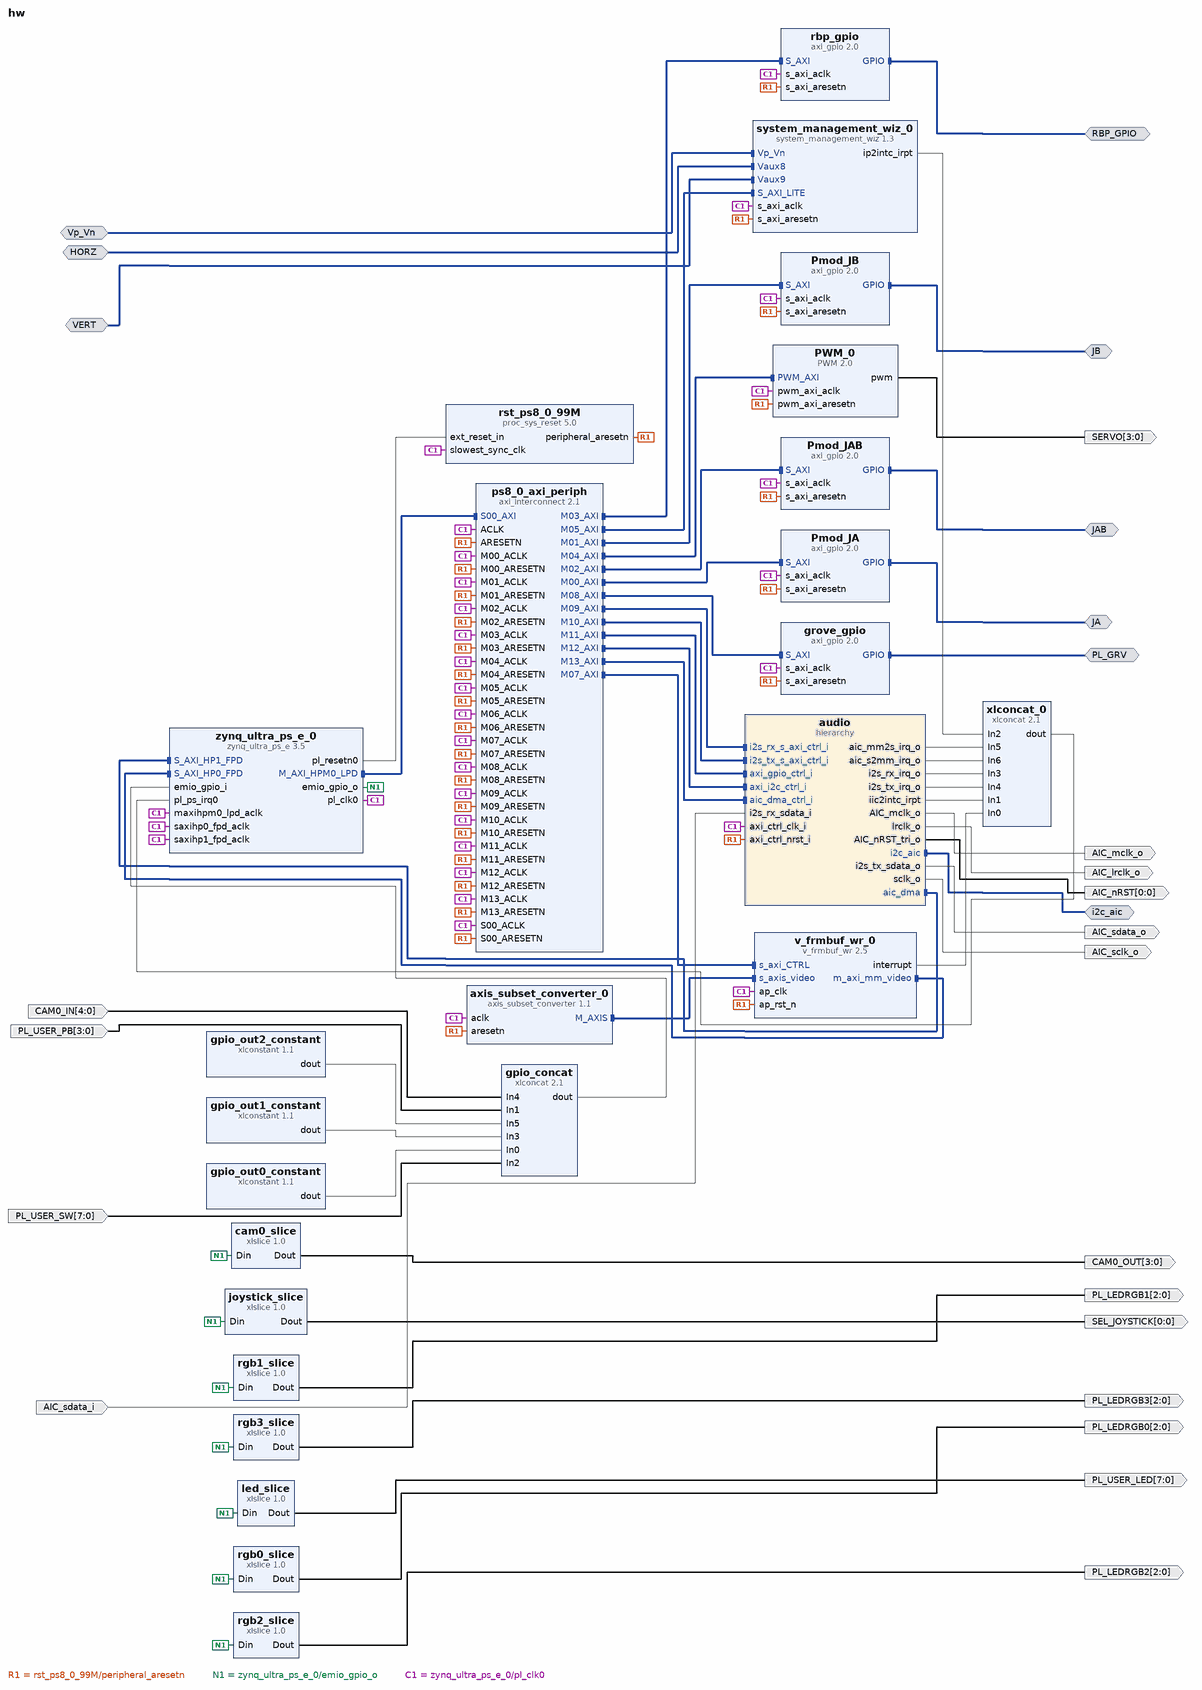
[diagram p0: block diagram of the top level]
# Vivado block design hw, xczu3eg-sfvc784-2-e, Vivado 2024.1
create_bd_design hw

create_bd_intf_port -mode Slave -vlnv xilinx.com:interface:diff_analog_io_rtl:1.0 HORZ
create_bd_intf_port -mode Master -vlnv xilinx.com:interface:gpio_rtl:1.0 JA
create_bd_intf_port -mode Master -vlnv xilinx.com:interface:gpio_rtl:1.0 JAB
create_bd_intf_port -mode Master -vlnv xilinx.com:interface:gpio_rtl:1.0 JB
create_bd_intf_port -mode Master -vlnv xilinx.com:interface:gpio_rtl:1.0 PL_GRV
create_bd_intf_port -mode Master -vlnv xilinx.com:interface:gpio_rtl:1.0 RBP_GPIO
create_bd_intf_port -mode Slave -vlnv xilinx.com:interface:diff_analog_io_rtl:1.0 VERT
create_bd_intf_port -mode Slave -vlnv xilinx.com:interface:diff_analog_io_rtl:1.0 Vp_Vn
create_bd_intf_port -mode Master -vlnv xilinx.com:interface:iic_rtl:1.0 i2c_aic
create_bd_port -dir O AIC_lrclk_o
create_bd_port -dir O AIC_mclk_o
create_bd_port -dir O -from 0 -to 0 AIC_nRST
create_bd_port -dir O AIC_sclk_o
create_bd_port -dir I AIC_sdata_i
create_bd_port -dir O AIC_sdata_o
create_bd_port -dir I -from 4 -to 0 CAM0_IN
create_bd_port -dir O -from 3 -to 0 CAM0_OUT
create_bd_port -dir O -from 2 -to 0 PL_LEDRGB0
create_bd_port -dir O -from 2 -to 0 PL_LEDRGB1
create_bd_port -dir O -from 2 -to 0 PL_LEDRGB2
create_bd_port -dir O -from 2 -to 0 PL_LEDRGB3
create_bd_port -dir O -from 7 -to 0 PL_USER_LED
create_bd_port -dir I -from 3 -to 0 PL_USER_PB
create_bd_port -dir I -from 7 -to 0 PL_USER_SW
create_bd_port -dir O -from 0 -to 0 SEL_JOYSTICK
create_bd_port -dir O -from 3 -to 0 SERVO

create_bd_cell -type ip -vlnv digilentinc.com:IP:PWM:2.0 PWM_0
set_property -dict {CONFIG.NUM_PWM 4} [get_bd_cells PWM_0]
create_bd_cell -type ip -vlnv xilinx.com:ip:axi_gpio:2.0 Pmod_JA
set_property -dict {CONFIG.C_GPIO_WIDTH 8} [get_bd_cells Pmod_JA]
create_bd_cell -type ip -vlnv xilinx.com:ip:axi_gpio:2.0 Pmod_JAB
set_property -dict {CONFIG.C_GPIO_WIDTH 6} [get_bd_cells Pmod_JAB]
create_bd_cell -type ip -vlnv xilinx.com:ip:axi_gpio:2.0 Pmod_JB
set_property -dict {CONFIG.C_GPIO_WIDTH 8} [get_bd_cells Pmod_JB]
create_bd_cell -type hier audio
create_bd_cell -type ip -vlnv xilinx.com:ip:axis_subset_converter:1.1 axis_subset_converter_0
set_property -dict {CONFIG.M_TDATA_NUM_BYTES 6} [get_bd_cells axis_subset_converter_0]
create_bd_cell -type ip -vlnv xilinx.com:ip:xlslice:1.0 cam0_slice
set_property -dict {CONFIG.DIN_FROM 37 CONFIG.DIN_TO 34 CONFIG.DIN_WIDTH 64 CONFIG.DOUT_WIDTH 4} [get_bd_cells cam0_slice]
create_bd_cell -type ip -vlnv xilinx.com:ip:xlconcat:2.1 gpio_concat
set_property -dict {CONFIG.NUM_PORTS 6} [get_bd_cells gpio_concat]
create_bd_cell -type ip -vlnv xilinx.com:ip:xlconstant:1.1 gpio_out0_constant
set_property -dict {CONFIG.CONST_VAL 0 CONFIG.CONST_WIDTH 20} [get_bd_cells gpio_out0_constant]
create_bd_cell -type ip -vlnv xilinx.com:ip:xlconstant:1.1 gpio_out1_constant
set_property -dict {CONFIG.CONST_VAL 0 CONFIG.CONST_WIDTH 6} [get_bd_cells gpio_out1_constant]
create_bd_cell -type ip -vlnv xilinx.com:ip:xlconstant:1.1 gpio_out2_constant
set_property -dict {CONFIG.CONST_VAL 0 CONFIG.CONST_WIDTH 21} [get_bd_cells gpio_out2_constant]
create_bd_cell -type ip -vlnv xilinx.com:ip:axi_gpio:2.0 grove_gpio
set_property -dict {CONFIG.C_GPIO_WIDTH 4 CONFIG.C_IS_DUAL 0} [get_bd_cells grove_gpio]
create_bd_cell -type ip -vlnv xilinx.com:ip:xlslice:1.0 joystick_slice
set_property -dict {CONFIG.DIN_FROM 32 CONFIG.DIN_TO 32 CONFIG.DIN_WIDTH 64 CONFIG.DOUT_WIDTH 1} [get_bd_cells joystick_slice]
create_bd_cell -type ip -vlnv xilinx.com:ip:xlslice:1.0 led_slice
set_property -dict {CONFIG.DIN_FROM 7 CONFIG.DIN_TO 0 CONFIG.DIN_WIDTH 64 CONFIG.DOUT_WIDTH 8} [get_bd_cells led_slice]
create_bd_cell -type ip -vlnv xilinx.com:ip:axi_interconnect:2.1 ps8_0_axi_periph
set_property -dict {CONFIG.NUM_MI 14 CONFIG.NUM_SI 1} [get_bd_cells ps8_0_axi_periph]
create_bd_cell -type ip -vlnv xilinx.com:ip:axi_gpio:2.0 rbp_gpio
set_property -dict {CONFIG.C_GPIO_WIDTH 28} [get_bd_cells rbp_gpio]
create_bd_cell -type ip -vlnv xilinx.com:ip:xlslice:1.0 rgb0_slice
set_property -dict {CONFIG.DIN_FROM 10 CONFIG.DIN_TO 8 CONFIG.DIN_WIDTH 64 CONFIG.DOUT_WIDTH 3} [get_bd_cells rgb0_slice]
create_bd_cell -type ip -vlnv xilinx.com:ip:xlslice:1.0 rgb1_slice
set_property -dict {CONFIG.DIN_FROM 13 CONFIG.DIN_TO 11 CONFIG.DIN_WIDTH 64 CONFIG.DOUT_WIDTH 3} [get_bd_cells rgb1_slice]
create_bd_cell -type ip -vlnv xilinx.com:ip:xlslice:1.0 rgb2_slice
set_property -dict {CONFIG.DIN_FROM 16 CONFIG.DIN_TO 14 CONFIG.DIN_WIDTH 64 CONFIG.DOUT_WIDTH 3} [get_bd_cells rgb2_slice]
create_bd_cell -type ip -vlnv xilinx.com:ip:xlslice:1.0 rgb3_slice
set_property -dict {CONFIG.DIN_FROM 19 CONFIG.DIN_TO 17 CONFIG.DIN_WIDTH 64 CONFIG.DOUT_WIDTH 3} [get_bd_cells rgb3_slice]
create_bd_cell -type ip -vlnv xilinx.com:ip:proc_sys_reset:5.0 rst_ps8_0_99M
create_bd_cell -type ip -vlnv xilinx.com:ip:system_management_wiz:1.3 system_management_wiz_0
set_property -dict [list \
  CONFIG.ANALOG_BANK_SELECTION 44 \
  CONFIG.BIPOLAR_VAUXP8_VAUXN8 false \
  CONFIG.BIPOLAR_VAUXP9_VAUXN9 false \
  CONFIG.BIPOLAR_VP_VN false \
  CONFIG.CHANNEL_ENABLE_VAUXP8_VAUXN8 true \
  CONFIG.CHANNEL_ENABLE_VAUXP9_VAUXN9 true \
  CONFIG.CHANNEL_ENABLE_VP_VN true \
  CONFIG.ENABLE_EXTERNAL_MUX false \
  CONFIG.EXTERNAL_MUXADDR_ENABLE false \
  CONFIG.INTERFACE_SELECTION Enable_AXI \
  CONFIG.VAUXN0_LOC AB9 \
  CONFIG.VAUXN10_LOC Y13 \
  CONFIG.VAUXN11_LOC W13 \
  CONFIG.VAUXN12_LOC AF13 \
  CONFIG.VAUXN13_LOC AH13 \
  CONFIG.VAUXN14_LOC AH14 \
  CONFIG.VAUXN15_LOC AE14 \
  CONFIG.VAUXN1_LOC AA8 \
  CONFIG.VAUXN2_LOC Y10 \
  CONFIG.VAUXN3_LOC AA10 \
  CONFIG.VAUXN4_LOC AC11 \
  CONFIG.VAUXN5_LOC AD10 \
  CONFIG.VAUXN6_LOC AD12 \
  CONFIG.VAUXN7_LOC AF12 \
  CONFIG.VAUXN8_LOC AA12 \
  CONFIG.VAUXN9_LOC W11 \
  CONFIG.VAUXP0_LOC AB10 \
  CONFIG.VAUXP10_LOC Y14 \
  CONFIG.VAUXP11_LOC W14 \
  CONFIG.VAUXP12_LOC AE13 \
  CONFIG.VAUXP13_LOC AG13 \
  CONFIG.VAUXP14_LOC AG14 \
  CONFIG.VAUXP15_LOC AE15 \
  CONFIG.VAUXP1_LOC Y9 \
  CONFIG.VAUXP2_LOC W10 \
  CONFIG.VAUXP3_LOC AA11 \
  CONFIG.VAUXP4_LOC AB11 \
  CONFIG.VAUXP5_LOC AD11 \
  CONFIG.VAUXP6_LOC AC12 \
  CONFIG.VAUXP7_LOC AE12 \
  CONFIG.VAUXP8_LOC Y12 \
  CONFIG.VAUXP9_LOC W12 \
] [get_bd_cells system_management_wiz_0]
create_bd_cell -type ip -vlnv xilinx.com:ip:v_frmbuf_wr:2.5 v_frmbuf_wr_0
create_bd_cell -type ip -vlnv xilinx.com:ip:xlconcat:2.1 xlconcat_0
set_property -dict {CONFIG.NUM_PORTS 7} [get_bd_cells xlconcat_0]
create_bd_cell -type ip -vlnv xilinx.com:ip:zynq_ultra_ps_e:3.5 zynq_ultra_ps_e_0
set_property -dict [list \
  CONFIG.CAN0_BOARD_INTERFACE custom \
  CONFIG.CAN1_BOARD_INTERFACE custom \
  CONFIG.CSU_BOARD_INTERFACE custom \
  CONFIG.DP_BOARD_INTERFACE custom \
  CONFIG.GEM0_BOARD_INTERFACE custom \
  CONFIG.GEM1_BOARD_INTERFACE custom \
  CONFIG.GEM2_BOARD_INTERFACE custom \
  CONFIG.GEM3_BOARD_INTERFACE custom \
  CONFIG.GPIO_BOARD_INTERFACE custom \
  CONFIG.IIC0_BOARD_INTERFACE custom \
  CONFIG.IIC1_BOARD_INTERFACE custom \
  CONFIG.NAND_BOARD_INTERFACE custom \
  CONFIG.PCIE_BOARD_INTERFACE custom \
  CONFIG.PJTAG_BOARD_INTERFACE custom \
  CONFIG.PMU_BOARD_INTERFACE custom \
  CONFIG.PSU_BANK_0_IO_STANDARD LVCMOS33 \
  CONFIG.PSU_BANK_1_IO_STANDARD LVCMOS33 \
  CONFIG.PSU_BANK_2_IO_STANDARD LVCMOS33 \
  CONFIG.PSU_BANK_3_IO_STANDARD LVCMOS18 \
  CONFIG.PSU_USB3__DUAL_CLOCK_ENABLE 1 \
  CONFIG.PSU__CAN1__PERIPHERAL__ENABLE 0 \
  CONFIG.PSU__CRF_APB__ACPU_CTRL__FREQMHZ 1200 \
  CONFIG.PSU__CRF_APB__ACPU_CTRL__SRCSEL APLL \
  CONFIG.PSU__CRF_APB__APLL_CTRL__SRCSEL PSS_REF_CLK \
  CONFIG.PSU__CRF_APB__DBG_FPD_CTRL__FREQMHZ 250 \
  CONFIG.PSU__CRF_APB__DBG_FPD_CTRL__SRCSEL IOPLL \
  CONFIG.PSU__CRF_APB__DBG_TRACE_CTRL__FREQMHZ 250 \
  CONFIG.PSU__CRF_APB__DBG_TRACE_CTRL__SRCSEL IOPLL \
  CONFIG.PSU__CRF_APB__DBG_TSTMP_CTRL__FREQMHZ 250 \
  CONFIG.PSU__CRF_APB__DBG_TSTMP_CTRL__SRCSEL IOPLL \
  CONFIG.PSU__CRF_APB__DDR_CTRL__FREQMHZ 1200 \
  CONFIG.PSU__CRF_APB__DDR_CTRL__SRCSEL DPLL \
  CONFIG.PSU__CRF_APB__DPDMA_REF_CTRL__FREQMHZ 600 \
  CONFIG.PSU__CRF_APB__DPDMA_REF_CTRL__SRCSEL DPLL \
  CONFIG.PSU__CRF_APB__DPLL_CTRL__SRCSEL PSS_REF_CLK \
  CONFIG.PSU__CRF_APB__DP_AUDIO_REF_CTRL__SRCSEL RPLL \
  CONFIG.PSU__CRF_APB__DP_STC_REF_CTRL__SRCSEL RPLL \
  CONFIG.PSU__CRF_APB__DP_VIDEO_REF_CTRL__SRCSEL DPLL \
  CONFIG.PSU__CRF_APB__GDMA_REF_CTRL__FREQMHZ 600 \
  CONFIG.PSU__CRF_APB__GDMA_REF_CTRL__SRCSEL DPLL \
  CONFIG.PSU__CRF_APB__GPU_REF_CTRL__FREQMHZ 600 \
  CONFIG.PSU__CRF_APB__GPU_REF_CTRL__SRCSEL DPLL \
  CONFIG.PSU__CRF_APB__TOPSW_LSBUS_CTRL__FREQMHZ 100 \
  CONFIG.PSU__CRF_APB__TOPSW_LSBUS_CTRL__SRCSEL IOPLL \
  CONFIG.PSU__CRF_APB__TOPSW_MAIN_CTRL__FREQMHZ 533.333 \
  CONFIG.PSU__CRF_APB__TOPSW_MAIN_CTRL__SRCSEL DPLL \
  CONFIG.PSU__CRF_APB__VPLL_CTRL__SRCSEL PSS_REF_CLK \
  CONFIG.PSU__CRL_APB__ADMA_REF_CTRL__FREQMHZ 533.333 \
  CONFIG.PSU__CRL_APB__ADMA_REF_CTRL__SRCSEL RPLL \
  CONFIG.PSU__CRL_APB__CAN1_REF_CTRL__FREQMHZ 100 \
  CONFIG.PSU__CRL_APB__CAN1_REF_CTRL__SRCSEL IOPLL \
  CONFIG.PSU__CRL_APB__CPU_R5_CTRL__FREQMHZ 500 \
  CONFIG.PSU__CRL_APB__CPU_R5_CTRL__SRCSEL IOPLL \
  CONFIG.PSU__CRL_APB__DBG_LPD_CTRL__FREQMHZ 250 \
  CONFIG.PSU__CRL_APB__DBG_LPD_CTRL__SRCSEL IOPLL \
  CONFIG.PSU__CRL_APB__GEM3_REF_CTRL__FREQMHZ 125 \
  CONFIG.PSU__CRL_APB__GEM3_REF_CTRL__SRCSEL IOPLL \
  CONFIG.PSU__CRL_APB__I2C0_REF_CTRL__FREQMHZ 100 \
  CONFIG.PSU__CRL_APB__I2C0_REF_CTRL__SRCSEL IOPLL \
  CONFIG.PSU__CRL_APB__I2C1_REF_CTRL__FREQMHZ 100 \
  CONFIG.PSU__CRL_APB__I2C1_REF_CTRL__SRCSEL IOPLL \
  CONFIG.PSU__CRL_APB__IOPLL_CTRL__SRCSEL PSS_REF_CLK \
  CONFIG.PSU__CRL_APB__IOU_SWITCH_CTRL__FREQMHZ 267 \
  CONFIG.PSU__CRL_APB__IOU_SWITCH_CTRL__SRCSEL RPLL \
  CONFIG.PSU__CRL_APB__LPD_LSBUS_CTRL__FREQMHZ 100 \
  CONFIG.PSU__CRL_APB__LPD_LSBUS_CTRL__SRCSEL IOPLL \
  CONFIG.PSU__CRL_APB__LPD_SWITCH_CTRL__FREQMHZ 533.333 \
  CONFIG.PSU__CRL_APB__LPD_SWITCH_CTRL__SRCSEL RPLL \
  CONFIG.PSU__CRL_APB__PCAP_CTRL__FREQMHZ 200 \
  CONFIG.PSU__CRL_APB__PCAP_CTRL__SRCSEL IOPLL \
  CONFIG.PSU__CRL_APB__PL0_REF_CTRL__FREQMHZ 100 \
  CONFIG.PSU__CRL_APB__PL0_REF_CTRL__SRCSEL IOPLL \
  CONFIG.PSU__CRL_APB__PL1_REF_CTRL__FREQMHZ 200 \
  CONFIG.PSU__CRL_APB__PL1_REF_CTRL__SRCSEL DPLL \
  CONFIG.PSU__CRL_APB__QSPI_REF_CTRL__FREQMHZ 300 \
  CONFIG.PSU__CRL_APB__QSPI_REF_CTRL__SRCSEL IOPLL \
  CONFIG.PSU__CRL_APB__RPLL_CTRL__SRCSEL PSS_REF_CLK \
  CONFIG.PSU__CRL_APB__SDIO0_REF_CTRL__SRCSEL IOPLL \
  CONFIG.PSU__CRL_APB__SDIO1_REF_CTRL__FREQMHZ 200 \
  CONFIG.PSU__CRL_APB__SDIO1_REF_CTRL__SRCSEL RPLL \
  CONFIG.PSU__CRL_APB__TIMESTAMP_REF_CTRL__FREQMHZ 100 \
  CONFIG.PSU__CRL_APB__TIMESTAMP_REF_CTRL__SRCSEL PSS_REF_CLK \
  CONFIG.PSU__CRL_APB__UART0_REF_CTRL__FREQMHZ 100 \
  CONFIG.PSU__CRL_APB__UART0_REF_CTRL__SRCSEL IOPLL \
  CONFIG.PSU__CRL_APB__UART1_REF_CTRL__FREQMHZ 100 \
  CONFIG.PSU__CRL_APB__UART1_REF_CTRL__SRCSEL IOPLL \
  CONFIG.PSU__CRL_APB__USB0_BUS_REF_CTRL__FREQMHZ 250 \
  CONFIG.PSU__CRL_APB__USB0_BUS_REF_CTRL__SRCSEL IOPLL \
  CONFIG.PSU__CRL_APB__USB3_DUAL_REF_CTRL__FREQMHZ 20 \
  CONFIG.PSU__CRL_APB__USB3_DUAL_REF_CTRL__SRCSEL IOPLL \
  CONFIG.PSU__CRL_APB__USB3__ENABLE 1 \
  CONFIG.PSU__CSUPMU__PERIPHERAL__VALID 0 \
  CONFIG.PSU__DDRC__BUS_WIDTH {32 Bit} \
  CONFIG.PSU__DDRC__COMPONENTS Components \
  CONFIG.PSU__DDRC__DEVICE_CAPACITY {16384 MBits} \
  CONFIG.PSU__DDRC__DRAM_WIDTH {8 Bits} \
  CONFIG.PSU__DDRC__ECC Disabled \
  CONFIG.PSU__DDRC__MEMORY_TYPE {DDR 4} \
  CONFIG.PSU__DDRC__SPEED_BIN DDR4_2400T \
  CONFIG.PSU__DDR_HIGH_ADDRESS_GUI_ENABLE 1 \
  CONFIG.PSU__DDR__INTERFACE__FREQMHZ 600.000 \
  CONFIG.PSU__DEVICE_TYPE EG \
  CONFIG.PSU__DISPLAYPORT__LANE0__ENABLE 1 \
  CONFIG.PSU__DISPLAYPORT__LANE0__IO {GT Lane1} \
  CONFIG.PSU__DISPLAYPORT__LANE1__ENABLE 1 \
  CONFIG.PSU__DISPLAYPORT__LANE1__IO {GT Lane0} \
  CONFIG.PSU__DISPLAYPORT__PERIPHERAL__ENABLE 1 \
  CONFIG.PSU__DLL__ISUSED 1 \
  CONFIG.PSU__DPAUX__PERIPHERAL__ENABLE 1 \
  CONFIG.PSU__DPAUX__PERIPHERAL__IO {MIO 27 .. 30} \
  CONFIG.PSU__DP__LANE_SEL {Dual Lower} \
  CONFIG.PSU__DP__REF_CLK_FREQ 27 \
  CONFIG.PSU__DP__REF_CLK_SEL {Ref Clk0} \
  CONFIG.PSU__ENET3__PERIPHERAL__ENABLE 0 \
  CONFIG.PSU__FPD_SLCR__WDT1__FREQMHZ 100 \
  CONFIG.PSU__FPGA_PL0_ENABLE 1 \
  CONFIG.PSU__FPGA_PL1_ENABLE 1 \
  CONFIG.PSU__GPIO0_MIO__IO {MIO 0 .. 25} \
  CONFIG.PSU__GPIO0_MIO__PERIPHERAL__ENABLE 1 \
  CONFIG.PSU__GPIO1_MIO__IO {MIO 26 .. 51} \
  CONFIG.PSU__GPIO1_MIO__PERIPHERAL__ENABLE 1 \
  CONFIG.PSU__GPIO2_MIO__IO {MIO 52 .. 77} \
  CONFIG.PSU__GPIO2_MIO__PERIPHERAL__ENABLE 1 \
  CONFIG.PSU__GPIO_EMIO_WIDTH 64 \
  CONFIG.PSU__GPIO_EMIO__PERIPHERAL__ENABLE 1 \
  CONFIG.PSU__GPIO_EMIO__PERIPHERAL__IO 64 \
  CONFIG.PSU__GT__LINK_SPEED HBR \
  CONFIG.PSU__GT__PRE_EMPH_LVL_4 0 \
  CONFIG.PSU__GT__VLT_SWNG_LVL_4 0 \
  CONFIG.PSU__I2C0__PERIPHERAL__ENABLE 1 \
  CONFIG.PSU__I2C0__PERIPHERAL__IO {MIO 34 .. 35} \
  CONFIG.PSU__I2C1__PERIPHERAL__ENABLE 1 \
  CONFIG.PSU__I2C1__PERIPHERAL__IO {MIO 36 .. 37} \
  CONFIG.PSU__IOU_SLCR__IOU_TTC_APB_CLK__TTC0_SEL APB \
  CONFIG.PSU__IOU_SLCR__IOU_TTC_APB_CLK__TTC1_SEL APB \
  CONFIG.PSU__IOU_SLCR__IOU_TTC_APB_CLK__TTC2_SEL APB \
  CONFIG.PSU__IOU_SLCR__IOU_TTC_APB_CLK__TTC3_SEL APB \
  CONFIG.PSU__IOU_SLCR__TTC0__FREQMHZ 100 \
  CONFIG.PSU__IOU_SLCR__TTC1__FREQMHZ 100 \
  CONFIG.PSU__IOU_SLCR__TTC2__FREQMHZ 100 \
  CONFIG.PSU__IOU_SLCR__TTC3__FREQMHZ 100 \
  CONFIG.PSU__IOU_SLCR__WDT0__FREQMHZ 100 \
  CONFIG.PSU__LPD_SLCR__CSUPMU__FREQMHZ 100 \
  CONFIG.PSU__OVERRIDE_HPX_QOS 0 \
  CONFIG.PSU__OVERRIDE__BASIC_CLOCK 0 \
  CONFIG.PSU__PMU__PERIPHERAL__ENABLE 0 \
  CONFIG.PSU__PRESET_APPLIED 0 \
  CONFIG.PSU__PSS_REF_CLK__FREQMHZ 33.33333 \
  CONFIG.PSU__QSPI__PERIPHERAL__ENABLE 0 \
  CONFIG.PSU__SATA__PERIPHERAL__ENABLE 0 \
  CONFIG.PSU__SD0__CLK_50_SDR_ITAP_DLY 0x15 \
  CONFIG.PSU__SD0__CLK_50_SDR_OTAP_DLY 0x5 \
  CONFIG.PSU__SD0__DATA_TRANSFER_MODE 4Bit \
  CONFIG.PSU__SD0__GRP_CD__ENABLE 1 \
  CONFIG.PSU__SD0__GRP_CD__IO {MIO 24} \
  CONFIG.PSU__SD0__PERIPHERAL__ENABLE 1 \
  CONFIG.PSU__SD0__PERIPHERAL__IO {MIO 13 .. 16 21 22} \
  CONFIG.PSU__SD0__SLOT_TYPE {SD 2.0} \
  CONFIG.PSU__SD1__CLK_100_SDR_OTAP_DLY 0x3 \
  CONFIG.PSU__SD1__CLK_200_SDR_OTAP_DLY 0x3 \
  CONFIG.PSU__SD1__CLK_50_DDR_ITAP_DLY 0x3D \
  CONFIG.PSU__SD1__CLK_50_DDR_OTAP_DLY 0x4 \
  CONFIG.PSU__SD1__CLK_50_SDR_ITAP_DLY 0x15 \
  CONFIG.PSU__SD1__CLK_50_SDR_OTAP_DLY 0x5 \
  CONFIG.PSU__SD1__PERIPHERAL__ENABLE 0 \
  CONFIG.PSU__SWDT0__PERIPHERAL__ENABLE 0 \
  CONFIG.PSU__SWDT1__PERIPHERAL__ENABLE 0 \
  CONFIG.PSU__TTC0__PERIPHERAL__ENABLE 0 \
  CONFIG.PSU__TTC1__PERIPHERAL__ENABLE 0 \
  CONFIG.PSU__TTC2__PERIPHERAL__ENABLE 0 \
  CONFIG.PSU__TTC3__PERIPHERAL__ENABLE 0 \
  CONFIG.PSU__UART0__PERIPHERAL__ENABLE 0 \
  CONFIG.PSU__UART1__BAUD_RATE 115200 \
  CONFIG.PSU__UART1__MODEM__ENABLE 0 \
  CONFIG.PSU__UART1__PERIPHERAL__ENABLE 1 \
  CONFIG.PSU__UART1__PERIPHERAL__IO {MIO 32 .. 33} \
  CONFIG.PSU__USB0_COHERENCY 0 \
  CONFIG.PSU__USB0__PERIPHERAL__ENABLE 1 \
  CONFIG.PSU__USB0__PERIPHERAL__IO {MIO 52 .. 63} \
  CONFIG.PSU__USB0__REF_CLK_FREQ 100 \
  CONFIG.PSU__USB0__REF_CLK_SEL {Ref Clk1} \
  CONFIG.PSU__USB0__RESET__ENABLE 1 \
  CONFIG.PSU__USB0__RESET__IO {MIO 76} \
  CONFIG.PSU__USB1__PERIPHERAL__ENABLE 1 \
  CONFIG.PSU__USB1__PERIPHERAL__IO {MIO 64 .. 75} \
  CONFIG.PSU__USB1__REF_CLK_FREQ 100 \
  CONFIG.PSU__USB1__REF_CLK_SEL {Ref Clk1} \
  CONFIG.PSU__USB2_0__EMIO__ENABLE 0 \
  CONFIG.PSU__USB3_0__EMIO__ENABLE 0 \
  CONFIG.PSU__USB3_0__PERIPHERAL__ENABLE 1 \
  CONFIG.PSU__USB3_0__PERIPHERAL__IO {GT Lane2} \
  CONFIG.PSU__USB3_1__PERIPHERAL__ENABLE 1 \
  CONFIG.PSU__USB3_1__PERIPHERAL__IO {GT Lane3} \
  CONFIG.PSU__USB__RESET__MODE {Shared MIO Pin} \
  CONFIG.PSU__USB__RESET__POLARITY {Active Low} \
  CONFIG.PSU__USE__IRQ0 1 \
  CONFIG.PSU__USE__M_AXI_GP0 0 \
  CONFIG.PSU__USE__M_AXI_GP1 0 \
  CONFIG.PSU__USE__M_AXI_GP2 1 \
  CONFIG.PSU__USE__S_AXI_GP2 1 \
  CONFIG.PSU__USE__S_AXI_GP3 1 \
  CONFIG.QSPI_BOARD_INTERFACE custom \
  CONFIG.SATA_BOARD_INTERFACE custom \
  CONFIG.SD0_BOARD_INTERFACE custom \
  CONFIG.SD1_BOARD_INTERFACE custom \
  CONFIG.SPI0_BOARD_INTERFACE custom \
  CONFIG.SPI1_BOARD_INTERFACE custom \
  CONFIG.SUBPRESET1 Custom \
  CONFIG.SUBPRESET2 Custom \
  CONFIG.SWDT0_BOARD_INTERFACE custom \
  CONFIG.SWDT1_BOARD_INTERFACE custom \
  CONFIG.TRACE_BOARD_INTERFACE custom \
  CONFIG.TTC0_BOARD_INTERFACE custom \
  CONFIG.TTC1_BOARD_INTERFACE custom \
  CONFIG.TTC2_BOARD_INTERFACE custom \
  CONFIG.TTC3_BOARD_INTERFACE custom \
  CONFIG.UART0_BOARD_INTERFACE custom \
  CONFIG.UART1_BOARD_INTERFACE custom \
  CONFIG.USB0_BOARD_INTERFACE custom \
  CONFIG.USB1_BOARD_INTERFACE custom \
] [get_bd_cells zynq_ultra_ps_e_0]
# 766 more settings of zynq_ultra_ps_e_0 are not shown: defaults, MIO pin electricals, DDR timing, and values the tool derives

# ---- hierarchy /audio ----
current_bd_instance /audio
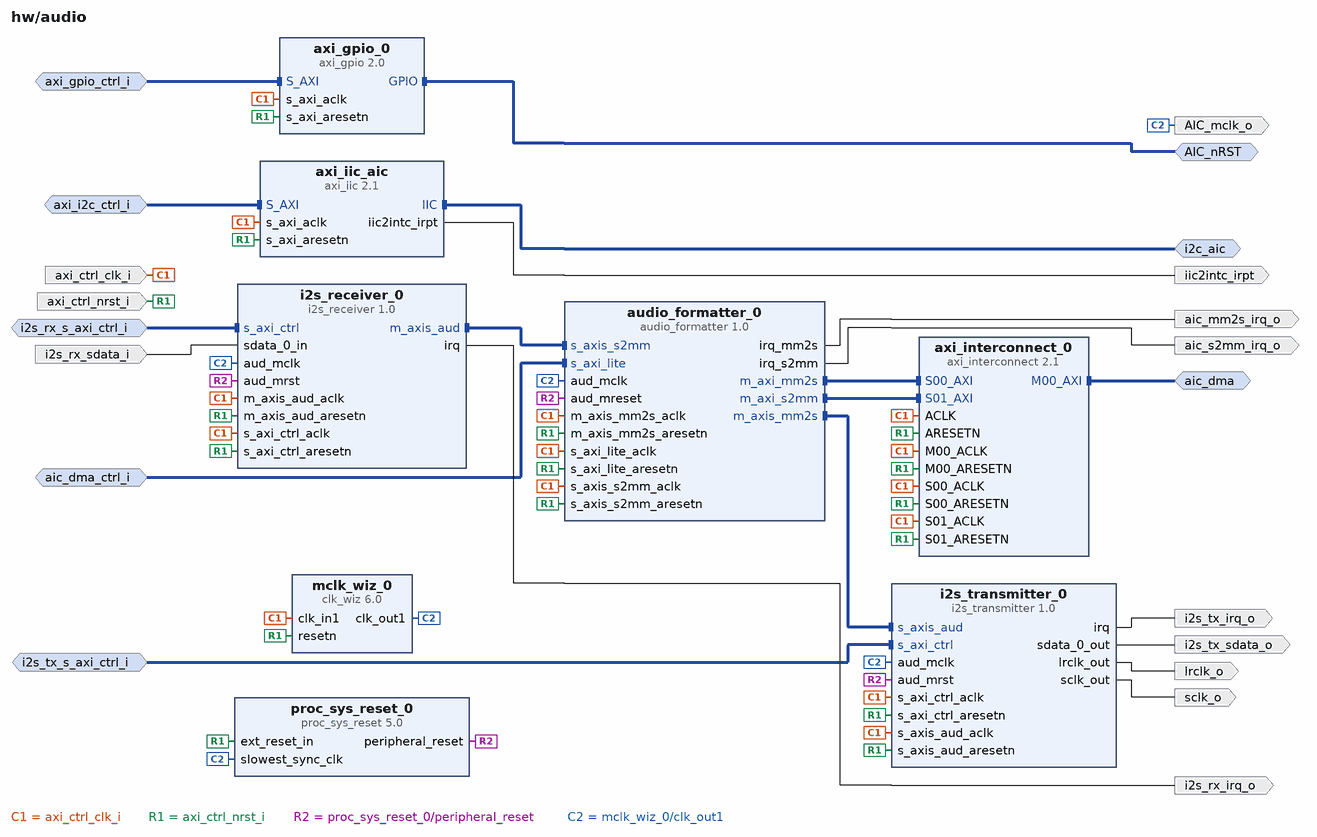
[diagram p1: block diagram inside /audio]
create_bd_intf_pin -mode Master -vlnv xilinx.com:interface:gpio_rtl:1.0 AIC_nRST
create_bd_intf_pin -mode Master -vlnv xilinx.com:interface:aximm_rtl:1.0 aic_dma
create_bd_intf_pin -mode Slave -vlnv xilinx.com:interface:aximm_rtl:1.0 aic_dma_ctrl_i
create_bd_intf_pin -mode Slave -vlnv xilinx.com:interface:aximm_rtl:1.0 axi_gpio_ctrl_i
create_bd_intf_pin -mode Slave -vlnv xilinx.com:interface:aximm_rtl:1.0 axi_i2c_ctrl_i
create_bd_intf_pin -mode Master -vlnv xilinx.com:interface:iic_rtl:1.0 i2c_aic
create_bd_intf_pin -mode Slave -vlnv xilinx.com:interface:aximm_rtl:1.0 i2s_rx_s_axi_ctrl_i
create_bd_intf_pin -mode Slave -vlnv xilinx.com:interface:aximm_rtl:1.0 i2s_tx_s_axi_ctrl_i
create_bd_pin -dir O AIC_mclk_o
create_bd_pin -dir O -type intr aic_mm2s_irq_o
create_bd_pin -dir O -type intr aic_s2mm_irq_o
create_bd_pin -dir I axi_ctrl_clk_i
create_bd_pin -dir I axi_ctrl_nrst_i
create_bd_pin -dir O -type intr i2s_rx_irq_o
create_bd_pin -dir I i2s_rx_sdata_i
create_bd_pin -dir O -type intr i2s_tx_irq_o
create_bd_pin -dir O i2s_tx_sdata_o
create_bd_pin -dir O -type intr iic2intc_irpt
create_bd_pin -dir O lrclk_o
create_bd_pin -dir O sclk_o

create_bd_cell -type ip -vlnv xilinx.com:ip:audio_formatter:1.0 audio_formatter_0
set_property -dict {CONFIG.C_MM2S_ADDR_WIDTH 32 CONFIG.C_S2MM_ADDR_WIDTH 32} [get_bd_cells audio_formatter_0]
create_bd_cell -type ip -vlnv xilinx.com:ip:axi_gpio:2.0 axi_gpio_0
set_property -dict {CONFIG.C_ALL_OUTPUTS 1 CONFIG.C_GPIO_WIDTH 1} [get_bd_cells axi_gpio_0]
create_bd_cell -type ip -vlnv xilinx.com:ip:axi_iic:2.1 axi_iic_aic
create_bd_cell -type ip -vlnv xilinx.com:ip:axi_interconnect:2.1 axi_interconnect_0
set_property -dict {CONFIG.NUM_MI 1 CONFIG.NUM_SI 2} [get_bd_cells axi_interconnect_0]
create_bd_cell -type ip -vlnv xilinx.com:ip:i2s_receiver:1.0 i2s_receiver_0
set_property -dict {CONFIG.C_DWIDTH 16} [get_bd_cells i2s_receiver_0]
create_bd_cell -type ip -vlnv xilinx.com:ip:i2s_transmitter:1.0 i2s_transmitter_0
set_property -dict {CONFIG.C_DWIDTH 24 CONFIG.C_IS_MASTER 1} [get_bd_cells i2s_transmitter_0]
create_bd_cell -type ip -vlnv xilinx.com:ip:clk_wiz:6.0 mclk_wiz_0
set_property -dict [list \
  CONFIG.CLKOUT1_JITTER 377.853 \
  CONFIG.CLKOUT1_PHASE_ERROR 474.126 \
  CONFIG.CLKOUT1_REQUESTED_OUT_FREQ 18.432 \
  CONFIG.MMCM_CLKFBOUT_MULT_F 88.750 \
  CONFIG.MMCM_CLKOUT0_DIVIDE_F 53.500 \
  CONFIG.MMCM_DIVCLK_DIVIDE 9 \
  CONFIG.RESET_PORT resetn \
  CONFIG.RESET_TYPE ACTIVE_LOW \
] [get_bd_cells mclk_wiz_0]
create_bd_cell -type ip -vlnv xilinx.com:ip:proc_sys_reset:5.0 proc_sys_reset_0

# ---- connections ----

current_bd_instance /audio
connect_bd_intf_net [get_bd_intf_pins i2s_rx_s_axi_ctrl_i] [get_bd_intf_pins i2s_receiver_0/s_axi_ctrl]
connect_bd_intf_net [get_bd_intf_pins i2s_tx_s_axi_ctrl_i] [get_bd_intf_pins i2s_transmitter_0/s_axi_ctrl]
connect_bd_intf_net [get_bd_intf_pins AIC_nRST] [get_bd_intf_pins axi_gpio_0/GPIO]
connect_bd_intf_net [get_bd_intf_pins axi_gpio_ctrl_i] [get_bd_intf_pins axi_gpio_0/S_AXI]
connect_bd_intf_net [get_bd_intf_pins i2c_aic] [get_bd_intf_pins axi_iic_aic/IIC]
connect_bd_intf_net [get_bd_intf_pins axi_i2c_ctrl_i] [get_bd_intf_pins axi_iic_aic/S_AXI]
connect_bd_intf_net [get_bd_intf_pins aic_dma] [get_bd_intf_pins axi_interconnect_0/M00_AXI]
connect_bd_intf_net [get_bd_intf_pins aic_dma_ctrl_i] [get_bd_intf_pins audio_formatter_0/s_axi_lite]
connect_bd_intf_net [get_bd_intf_pins audio_formatter_0/m_axi_mm2s] [get_bd_intf_pins axi_interconnect_0/S00_AXI]
connect_bd_intf_net [get_bd_intf_pins audio_formatter_0/m_axi_s2mm] [get_bd_intf_pins axi_interconnect_0/S01_AXI]
connect_bd_intf_net [get_bd_intf_pins audio_formatter_0/m_axis_mm2s] [get_bd_intf_pins i2s_transmitter_0/s_axis_aud]
connect_bd_intf_net [get_bd_intf_pins audio_formatter_0/s_axis_s2mm] [get_bd_intf_pins i2s_receiver_0/m_axis_aud]
connect_bd_net [get_bd_pins axi_ctrl_clk_i] \
  [get_bd_pins audio_formatter_0/m_axis_mm2s_aclk] [get_bd_pins audio_formatter_0/s_axi_lite_aclk] \
  [get_bd_pins audio_formatter_0/s_axis_s2mm_aclk] [get_bd_pins axi_gpio_0/s_axi_aclk] [get_bd_pins axi_iic_aic/s_axi_aclk] \
  [get_bd_pins axi_interconnect_0/ACLK] [get_bd_pins axi_interconnect_0/M00_ACLK] [get_bd_pins axi_interconnect_0/S00_ACLK] \
  [get_bd_pins axi_interconnect_0/S01_ACLK] [get_bd_pins i2s_receiver_0/m_axis_aud_aclk] \
  [get_bd_pins i2s_receiver_0/s_axi_ctrl_aclk] [get_bd_pins i2s_transmitter_0/s_axi_ctrl_aclk] \
  [get_bd_pins i2s_transmitter_0/s_axis_aud_aclk] [get_bd_pins mclk_wiz_0/clk_in1]
connect_bd_net [get_bd_pins axi_ctrl_nrst_i] \
  [get_bd_pins audio_formatter_0/m_axis_mm2s_aresetn] [get_bd_pins audio_formatter_0/s_axi_lite_aresetn] \
  [get_bd_pins audio_formatter_0/s_axis_s2mm_aresetn] [get_bd_pins axi_gpio_0/s_axi_aresetn] \
  [get_bd_pins axi_iic_aic/s_axi_aresetn] [get_bd_pins axi_interconnect_0/ARESETN] \
  [get_bd_pins axi_interconnect_0/M00_ARESETN] [get_bd_pins axi_interconnect_0/S00_ARESETN] \
  [get_bd_pins axi_interconnect_0/S01_ARESETN] [get_bd_pins i2s_receiver_0/m_axis_aud_aresetn] \
  [get_bd_pins i2s_receiver_0/s_axi_ctrl_aresetn] [get_bd_pins i2s_transmitter_0/s_axi_ctrl_aresetn] \
  [get_bd_pins i2s_transmitter_0/s_axis_aud_aresetn] [get_bd_pins mclk_wiz_0/resetn] \
  [get_bd_pins proc_sys_reset_0/ext_reset_in]
connect_bd_net -net aud_mrst_0_1 [get_bd_pins proc_sys_reset_0/peripheral_reset] \
  [get_bd_pins audio_formatter_0/aud_mreset] [get_bd_pins i2s_receiver_0/aud_mrst] [get_bd_pins i2s_transmitter_0/aud_mrst]
connect_bd_net [get_bd_pins audio_formatter_0/irq_mm2s] [get_bd_pins aic_mm2s_irq_o]
connect_bd_net [get_bd_pins audio_formatter_0/irq_s2mm] [get_bd_pins aic_s2mm_irq_o]
connect_bd_net [get_bd_pins axi_iic_aic/iic2intc_irpt] [get_bd_pins iic2intc_irpt]
connect_bd_net [get_bd_pins i2s_receiver_0/irq] [get_bd_pins i2s_rx_irq_o]
connect_bd_net [get_bd_pins i2s_transmitter_0/irq] [get_bd_pins i2s_tx_irq_o]
connect_bd_net [get_bd_pins i2s_transmitter_0/lrclk_out] [get_bd_pins lrclk_o]
connect_bd_net [get_bd_pins i2s_transmitter_0/sclk_out] [get_bd_pins sclk_o]
connect_bd_net [get_bd_pins i2s_transmitter_0/sdata_0_out] [get_bd_pins i2s_tx_sdata_o]
connect_bd_net [get_bd_pins mclk_wiz_0/clk_out1] \
  [get_bd_pins AIC_mclk_o] [get_bd_pins audio_formatter_0/aud_mclk] [get_bd_pins i2s_receiver_0/aud_mclk] \
  [get_bd_pins i2s_transmitter_0/aud_mclk] [get_bd_pins proc_sys_reset_0/slowest_sync_clk]
connect_bd_net -net sdata_0_in_0_1 [get_bd_pins i2s_rx_sdata_i] [get_bd_pins i2s_receiver_0/sdata_0_in]

current_bd_instance /
connect_bd_intf_net [get_bd_intf_ports JAB] [get_bd_intf_pins Pmod_JAB/GPIO]
connect_bd_intf_net [get_bd_intf_ports JB] [get_bd_intf_pins Pmod_JB/GPIO]
connect_bd_intf_net -intf_net Vp_Vn_0_1 [get_bd_intf_ports Vp_Vn] [get_bd_intf_pins system_management_wiz_0/Vp_Vn]
connect_bd_intf_net [get_bd_intf_pins audio/aic_dma] [get_bd_intf_pins zynq_ultra_ps_e_0/S_AXI_HP1_FPD]
connect_bd_intf_net [get_bd_intf_ports i2c_aic] [get_bd_intf_pins audio/i2c_aic]
connect_bd_intf_net -intf_net axi_gpio_0_GPIO [get_bd_intf_ports PL_GRV] [get_bd_intf_pins grove_gpio/GPIO]
connect_bd_intf_net -intf_net axi_gpio_ja [get_bd_intf_ports JA] [get_bd_intf_pins Pmod_JA/GPIO]
connect_bd_intf_net [get_bd_intf_pins axis_subset_converter_0/M_AXIS] [get_bd_intf_pins v_frmbuf_wr_0/s_axis_video]
connect_bd_intf_net -intf_net diff_analog_io_rtl_0_1 [get_bd_intf_ports HORZ] [get_bd_intf_pins system_management_wiz_0/Vaux8]
connect_bd_intf_net -intf_net diff_analog_io_rtl_1_1 [get_bd_intf_ports VERT] [get_bd_intf_pins system_management_wiz_0/Vaux9]
connect_bd_intf_net [get_bd_intf_pins Pmod_JA/S_AXI] [get_bd_intf_pins ps8_0_axi_periph/M00_AXI]
connect_bd_intf_net [get_bd_intf_pins Pmod_JB/S_AXI] [get_bd_intf_pins ps8_0_axi_periph/M01_AXI]
connect_bd_intf_net [get_bd_intf_pins Pmod_JAB/S_AXI] [get_bd_intf_pins ps8_0_axi_periph/M02_AXI]
connect_bd_intf_net [get_bd_intf_pins ps8_0_axi_periph/M03_AXI] [get_bd_intf_pins rbp_gpio/S_AXI]
connect_bd_intf_net [get_bd_intf_pins PWM_0/PWM_AXI] [get_bd_intf_pins ps8_0_axi_periph/M04_AXI]
connect_bd_intf_net [get_bd_intf_pins ps8_0_axi_periph/M05_AXI] [get_bd_intf_pins system_management_wiz_0/S_AXI_LITE]
connect_bd_intf_net [get_bd_intf_pins ps8_0_axi_periph/M07_AXI] [get_bd_intf_pins v_frmbuf_wr_0/s_axi_CTRL]
connect_bd_intf_net [get_bd_intf_pins grove_gpio/S_AXI] [get_bd_intf_pins ps8_0_axi_periph/M08_AXI]
connect_bd_intf_net [get_bd_intf_pins audio/i2s_rx_s_axi_ctrl_i] [get_bd_intf_pins ps8_0_axi_periph/M09_AXI]
connect_bd_intf_net [get_bd_intf_pins audio/i2s_tx_s_axi_ctrl_i] [get_bd_intf_pins ps8_0_axi_periph/M10_AXI]
connect_bd_intf_net [get_bd_intf_pins audio/axi_gpio_ctrl_i] [get_bd_intf_pins ps8_0_axi_periph/M11_AXI]
connect_bd_intf_net [get_bd_intf_pins audio/axi_i2c_ctrl_i] [get_bd_intf_pins ps8_0_axi_periph/M12_AXI]
connect_bd_intf_net [get_bd_intf_pins audio/aic_dma_ctrl_i] [get_bd_intf_pins ps8_0_axi_periph/M13_AXI]
connect_bd_intf_net [get_bd_intf_ports RBP_GPIO] [get_bd_intf_pins rbp_gpio/GPIO]
connect_bd_intf_net [get_bd_intf_pins v_frmbuf_wr_0/m_axi_mm_video] [get_bd_intf_pins zynq_ultra_ps_e_0/S_AXI_HP0_FPD]
connect_bd_intf_net [get_bd_intf_pins ps8_0_axi_periph/S00_AXI] [get_bd_intf_pins zynq_ultra_ps_e_0/M_AXI_HPM0_LPD]
connect_bd_net -net CAM0_INPUT_1 [get_bd_ports CAM0_IN] [get_bd_pins gpio_concat/In4]
connect_bd_net [get_bd_ports PL_USER_PB] [get_bd_pins gpio_concat/In1]
connect_bd_net [get_bd_ports PL_USER_SW] [get_bd_pins gpio_concat/In2]
connect_bd_net [get_bd_pins PWM_0/pwm] [get_bd_ports SERVO]
connect_bd_net [get_bd_pins audio/AIC_mclk_o] [get_bd_ports AIC_mclk_o]
connect_bd_net [get_bd_pins audio/AIC_nRST_tri_o] [get_bd_ports AIC_nRST]
connect_bd_net [get_bd_pins audio/aic_mm2s_irq_o] [get_bd_pins xlconcat_0/In5]
connect_bd_net [get_bd_pins audio/aic_s2mm_irq_o] [get_bd_pins xlconcat_0/In6]
connect_bd_net [get_bd_pins audio/i2s_rx_irq_o] [get_bd_pins xlconcat_0/In3]
connect_bd_net [get_bd_pins audio/i2s_tx_irq_o] [get_bd_pins xlconcat_0/In4]
connect_bd_net [get_bd_pins audio/i2s_tx_sdata_o] [get_bd_ports AIC_sdata_o]
connect_bd_net [get_bd_pins audio/iic2intc_irpt] [get_bd_pins xlconcat_0/In1]
connect_bd_net [get_bd_pins audio/lrclk_o] [get_bd_ports AIC_lrclk_o]
connect_bd_net [get_bd_pins audio/sclk_o] [get_bd_ports AIC_sclk_o]
connect_bd_net [get_bd_pins cam0_slice/Dout] [get_bd_ports CAM0_OUT]
connect_bd_net [get_bd_pins gpio_concat/dout] [get_bd_pins zynq_ultra_ps_e_0/emio_gpio_i]
connect_bd_net [get_bd_pins gpio_out2_constant/dout] [get_bd_pins gpio_concat/In5]
connect_bd_net -net gpio_unused_constant_dout [get_bd_pins gpio_out1_constant/dout] [get_bd_pins gpio_concat/In3]
connect_bd_net -net i2s_rx_sdata_i_0_1 [get_bd_ports AIC_sdata_i] [get_bd_pins audio/i2s_rx_sdata_i]
connect_bd_net [get_bd_pins joystick_slice/Dout] [get_bd_ports SEL_JOYSTICK]
connect_bd_net [get_bd_pins rgb1_slice/Dout] [get_bd_ports PL_LEDRGB1]
connect_bd_net [get_bd_pins rgb3_slice/Dout] [get_bd_ports PL_LEDRGB3]
connect_bd_net [get_bd_pins rst_ps8_0_99M/peripheral_aresetn] \
  [get_bd_pins PWM_0/pwm_axi_aresetn] [get_bd_pins Pmod_JA/s_axi_aresetn] [get_bd_pins Pmod_JAB/s_axi_aresetn] \
  [get_bd_pins Pmod_JB/s_axi_aresetn] [get_bd_pins audio/axi_ctrl_nrst_i] [get_bd_pins axis_subset_converter_0/aresetn] \
  [get_bd_pins grove_gpio/s_axi_aresetn] [get_bd_pins ps8_0_axi_periph/ARESETN] [get_bd_pins ps8_0_axi_periph/M00_ARESETN] \
  [get_bd_pins ps8_0_axi_periph/M01_ARESETN] [get_bd_pins ps8_0_axi_periph/M02_ARESETN] \
  [get_bd_pins ps8_0_axi_periph/M03_ARESETN] [get_bd_pins ps8_0_axi_periph/M04_ARESETN] \
  [get_bd_pins ps8_0_axi_periph/M05_ARESETN] [get_bd_pins ps8_0_axi_periph/M06_ARESETN] \
  [get_bd_pins ps8_0_axi_periph/M07_ARESETN] [get_bd_pins ps8_0_axi_periph/M08_ARESETN] \
  [get_bd_pins ps8_0_axi_periph/M09_ARESETN] [get_bd_pins ps8_0_axi_periph/M10_ARESETN] \
  [get_bd_pins ps8_0_axi_periph/M11_ARESETN] [get_bd_pins ps8_0_axi_periph/M12_ARESETN] \
  [get_bd_pins ps8_0_axi_periph/M13_ARESETN] [get_bd_pins ps8_0_axi_periph/S00_ARESETN] [get_bd_pins rbp_gpio/s_axi_aresetn] \
  [get_bd_pins system_management_wiz_0/s_axi_aresetn] [get_bd_pins v_frmbuf_wr_0/ap_rst_n]
connect_bd_net [get_bd_pins system_management_wiz_0/ip2intc_irpt] [get_bd_pins xlconcat_0/In2]
connect_bd_net [get_bd_pins v_frmbuf_wr_0/interrupt] [get_bd_pins xlconcat_0/In0]
connect_bd_net [get_bd_pins xlconcat_0/dout] [get_bd_pins zynq_ultra_ps_e_0/pl_ps_irq0]
connect_bd_net -net xlconstant_0_dout [get_bd_pins gpio_out0_constant/dout] [get_bd_pins gpio_concat/In0]
connect_bd_net -net xlslice_0_Dout [get_bd_pins led_slice/Dout] [get_bd_ports PL_USER_LED]
connect_bd_net -net xlslice_0_Dout1 [get_bd_pins rgb0_slice/Dout] [get_bd_ports PL_LEDRGB0]
connect_bd_net -net xlslice_0_Dout2 [get_bd_pins rgb2_slice/Dout] [get_bd_ports PL_LEDRGB2]
connect_bd_net [get_bd_pins zynq_ultra_ps_e_0/emio_gpio_o] \
  [get_bd_pins cam0_slice/Din] [get_bd_pins joystick_slice/Din] [get_bd_pins led_slice/Din] [get_bd_pins rgb0_slice/Din] \
  [get_bd_pins rgb1_slice/Din] [get_bd_pins rgb2_slice/Din] [get_bd_pins rgb3_slice/Din]
connect_bd_net [get_bd_pins zynq_ultra_ps_e_0/pl_clk0] \
  [get_bd_pins PWM_0/pwm_axi_aclk] [get_bd_pins Pmod_JA/s_axi_aclk] [get_bd_pins Pmod_JAB/s_axi_aclk] \
  [get_bd_pins Pmod_JB/s_axi_aclk] [get_bd_pins audio/axi_ctrl_clk_i] [get_bd_pins axis_subset_converter_0/aclk] \
  [get_bd_pins grove_gpio/s_axi_aclk] [get_bd_pins ps8_0_axi_periph/ACLK] [get_bd_pins ps8_0_axi_periph/M00_ACLK] \
  [get_bd_pins ps8_0_axi_periph/M01_ACLK] [get_bd_pins ps8_0_axi_periph/M02_ACLK] [get_bd_pins ps8_0_axi_periph/M03_ACLK] \
  [get_bd_pins ps8_0_axi_periph/M04_ACLK] [get_bd_pins ps8_0_axi_periph/M05_ACLK] [get_bd_pins ps8_0_axi_periph/M06_ACLK] \
  [get_bd_pins ps8_0_axi_periph/M07_ACLK] [get_bd_pins ps8_0_axi_periph/M08_ACLK] [get_bd_pins ps8_0_axi_periph/M09_ACLK] \
  [get_bd_pins ps8_0_axi_periph/M10_ACLK] [get_bd_pins ps8_0_axi_periph/M11_ACLK] [get_bd_pins ps8_0_axi_periph/M12_ACLK] \
  [get_bd_pins ps8_0_axi_periph/M13_ACLK] [get_bd_pins ps8_0_axi_periph/S00_ACLK] [get_bd_pins rbp_gpio/s_axi_aclk] \
  [get_bd_pins rst_ps8_0_99M/slowest_sync_clk] [get_bd_pins system_management_wiz_0/s_axi_aclk] \
  [get_bd_pins v_frmbuf_wr_0/ap_clk] [get_bd_pins zynq_ultra_ps_e_0/maxihpm0_lpd_aclk] \
  [get_bd_pins zynq_ultra_ps_e_0/saxihp0_fpd_aclk] [get_bd_pins zynq_ultra_ps_e_0/saxihp1_fpd_aclk]
connect_bd_net [get_bd_pins zynq_ultra_ps_e_0/pl_resetn0] [get_bd_pins rst_ps8_0_99M/ext_reset_in]

# ---- address map ----
assign_bd_address -offset 0x00000000 -range 2G -target_address_space [get_bd_addr_spaces audio/audio_formatter_0/m_axi_mm2s] [get_bd_addr_segs zynq_ultra_ps_e_0/SAXIGP3/HP1_DDR_LOW]
exclude_bd_addr_seg -offset 0xFF000000 -range 16M -target_address_space [get_bd_addr_spaces audio/audio_formatter_0/m_axi_mm2s] [get_bd_addr_segs zynq_ultra_ps_e_0/SAXIGP3/HP1_LPS_OCM]
exclude_bd_addr_seg -offset 0x800000000 -range 4G -target_address_space [get_bd_addr_spaces audio/audio_formatter_0/m_axi_mm2s] [get_bd_addr_segs zynq_ultra_ps_e_0/SAXIGP3/HP1_DDR_HIGH]
assign_bd_address -offset 0x00000000 -range 2G -target_address_space [get_bd_addr_spaces audio/audio_formatter_0/m_axi_s2mm] [get_bd_addr_segs zynq_ultra_ps_e_0/SAXIGP3/HP1_DDR_LOW]
exclude_bd_addr_seg -offset 0xFF000000 -range 16M -target_address_space [get_bd_addr_spaces audio/audio_formatter_0/m_axi_s2mm] [get_bd_addr_segs zynq_ultra_ps_e_0/SAXIGP3/HP1_LPS_OCM]
exclude_bd_addr_seg -offset 0x800000000 -range 32G -target_address_space [get_bd_addr_spaces audio/audio_formatter_0/m_axi_s2mm] [get_bd_addr_segs zynq_ultra_ps_e_0/SAXIGP3/HP1_DDR_HIGH]
assign_bd_address -offset 0x00000000 -range 2G -target_address_space [get_bd_addr_spaces v_frmbuf_wr_0/Data_m_axi_mm_video] [get_bd_addr_segs zynq_ultra_ps_e_0/SAXIGP2/HP0_DDR_LOW]
exclude_bd_addr_seg -offset 0xFF000000 -range 16M -target_address_space [get_bd_addr_spaces v_frmbuf_wr_0/Data_m_axi_mm_video] [get_bd_addr_segs zynq_ultra_ps_e_0/SAXIGP2/HP0_LPS_OCM]
exclude_bd_addr_seg -offset 0x800000000 -range 4G -target_address_space [get_bd_addr_spaces v_frmbuf_wr_0/Data_m_axi_mm_video] [get_bd_addr_segs zynq_ultra_ps_e_0/SAXIGP2/HP0_DDR_HIGH]
assign_bd_address -offset 0x0080000000 -range 64K -target_address_space [get_bd_addr_spaces zynq_ultra_ps_e_0/Data] [get_bd_addr_segs Pmod_JA/S_AXI/Reg]
assign_bd_address -offset 0x0080010000 -range 64K -target_address_space [get_bd_addr_spaces zynq_ultra_ps_e_0/Data] [get_bd_addr_segs Pmod_JAB/S_AXI/Reg]
assign_bd_address -offset 0x0080020000 -range 64K -target_address_space [get_bd_addr_spaces zynq_ultra_ps_e_0/Data] [get_bd_addr_segs Pmod_JB/S_AXI/Reg]
assign_bd_address -offset 0x0080030000 -range 64K -target_address_space [get_bd_addr_spaces zynq_ultra_ps_e_0/Data] [get_bd_addr_segs rbp_gpio/S_AXI/Reg]
assign_bd_address -offset 0x0080040000 -range 64K -target_address_space [get_bd_addr_spaces zynq_ultra_ps_e_0/Data] [get_bd_addr_segs grove_gpio/S_AXI/Reg]
assign_bd_address -offset 0x0080050000 -range 64K -target_address_space [get_bd_addr_spaces zynq_ultra_ps_e_0/Data] [get_bd_addr_segs audio/axi_gpio_0/S_AXI/Reg]
assign_bd_address -offset 0x0080060000 -range 64K -target_address_space [get_bd_addr_spaces zynq_ultra_ps_e_0/Data] [get_bd_addr_segs PWM_0/PWM_AXI/PWM_AXI_reg]
assign_bd_address -offset 0x0080070000 -range 64K -target_address_space [get_bd_addr_spaces zynq_ultra_ps_e_0/Data] [get_bd_addr_segs system_management_wiz_0/S_AXI_LITE/Reg]
assign_bd_address -offset 0x0080080000 -range 64K -target_address_space [get_bd_addr_spaces zynq_ultra_ps_e_0/Data] [get_bd_addr_segs v_frmbuf_wr_0/s_axi_CTRL/Reg]
assign_bd_address -offset 0x00800A0000 -range 64K -target_address_space [get_bd_addr_spaces zynq_ultra_ps_e_0/Data] [get_bd_addr_segs audio/axi_iic_aic/S_AXI/Reg]
assign_bd_address -offset 0x00800B0000 -range 64K -target_address_space [get_bd_addr_spaces zynq_ultra_ps_e_0/Data] [get_bd_addr_segs audio/i2s_receiver_0/s_axi_ctrl/Reg]
assign_bd_address -offset 0x00800C0000 -range 64K -target_address_space [get_bd_addr_spaces zynq_ultra_ps_e_0/Data] [get_bd_addr_segs audio/i2s_transmitter_0/s_axi_ctrl/Reg]
assign_bd_address -offset 0x00800D0000 -range 64K -target_address_space [get_bd_addr_spaces zynq_ultra_ps_e_0/Data] [get_bd_addr_segs audio/audio_formatter_0/s_axi_lite/reg0]

validate_bd_design
save_bd_design
